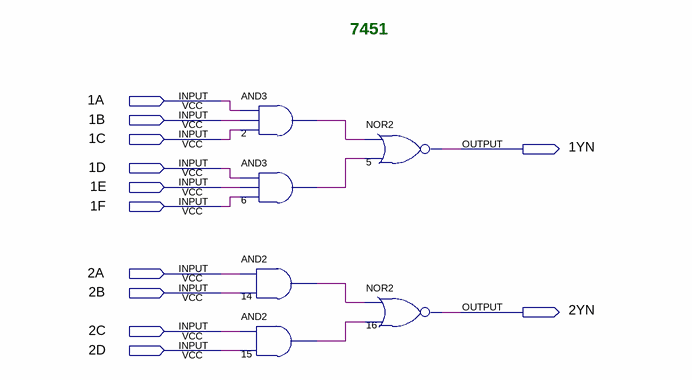
[diagram p0: schematic sheet]
// Quartus schematic 7451.bdf as structural Verilog: 6 symbols, 12 pins
module \7451  (
  input  \1A ,
  input  \1B ,
  input  \1C ,
  input  \1D ,
  input  \1E ,
  input  \1F ,
  input  \2A ,
  input  \2B ,
  input  \2C ,
  input  \2D ,
  output \1YN ,
  output \2YN 
);

  wire n2_out, n6_out, n14_out, n15_out;

  and u_2 (n2_out, \1A , \1B , \1C );
  and u_6 (n6_out, \1D , \1E , \1F );
  and u_14 (n14_out, \2A , \2B );
  and u_15 (n15_out, \2C , \2D );
  nor u_5 (\1YN , n2_out, n6_out);
  nor u_16 (\2YN , n14_out, n15_out);

  // Notes on the sheet:
  //   7451
endmodule
